# Altium project LedFlex.PrjPcb (part 4 of 4)
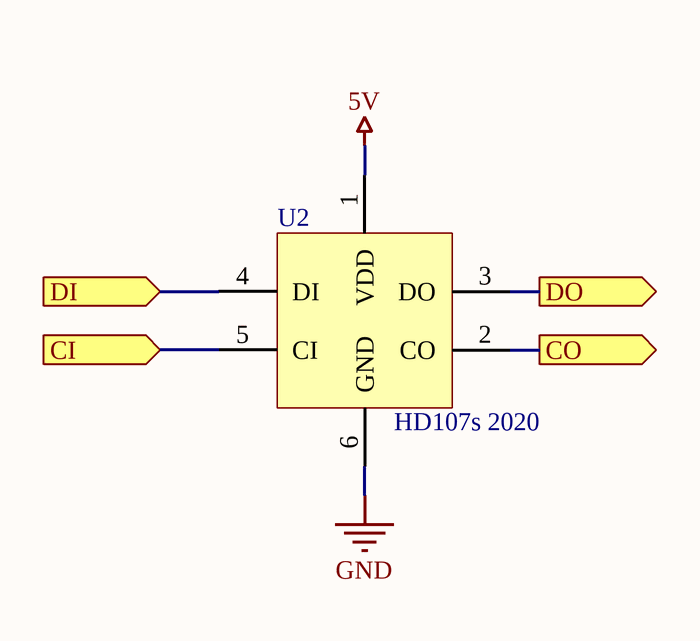
[diagram p4: LED_B.SchDoc]

## Nets that join several sheets (continued)
CI164: LEDA163 (U1_163.2), LEDA164 (U1_164.5)
CI165: LEDA164 (U1_164.2), LEDA165 (U1_165.5)
CI166: LEDA165 (U1_165.2), LEDA166 (U1_166.5)
CI167: LEDA166 (U1_166.2), LEDA167 (U1_167.5)
CI168: LEDA167 (U1_167.2), LEDA168 (U1_168.5)
CI169: LEDA168 (U1_168.2), LEDA169 (U1_169.5)
CI170: LEDA169 (U1_169.2), LEDA170 (U1_170.5)
CI171: LEDA170 (U1_170.2), LEDA171 (U1_171.5)
CI172: LEDA171 (U1_171.2), LEDA172 (U1_172.5)
CI173: LEDA172 (U1_172.2), LEDA173 (U1_173.5)
CI174: LEDA173 (U1_173.2), LEDA174 (U1_174.5)
CI175: LEDA174 (U1_174.2), LEDA175 (U1_175.5)
CI176: LEDA175 (U1_175.2), LEDA176 (U1_176.5)
CI177: LEDA176 (U1_176.2), LEDA177 (U1_177.5)
CI178: LEDA177 (U1_177.2), LEDA178 (U1_178.5)
CI179: LEDA178 (U1_178.2), LEDA179 (U1_179.5)
CI180: LEDA179 (U1_179.2), LEDA180 (U1_180.5)
CI181: LEDA180 (U1_180.2), LEDA181 (U1_181.5)
CI182: LEDA181 (U1_181.2), LEDA182 (U1_182.5)
CI183: LEDA182 (U1_182.2), LEDA183 (U1_183.5)
CI184: LEDA183 (U1_183.2), LEDA184 (U1_184.5)
CI185: LEDA184 (U1_184.2), LEDA185 (U1_185.5)
CI186: LEDA185 (U1_185.2), LEDA186 (U1_186.5)
CI187: LEDA186 (U1_186.2), LEDA187 (U1_187.5)
CI188: LEDA187 (U1_187.2), LEDA188 (U1_188.5)
CI189: LEDA188 (U1_188.2), LEDA189 (U1_189.5)
CI190: LEDA189 (U1_189.2), LEDA190 (U1_190.5)
CI191: LEDA190 (U1_190.2), LEDA191 (U1_191.5)
CI192: LEDA191 (U1_191.2), LEDA192 (U1_192.5)
CI193: LEDA192 (U1_192.2), LEDA193 (U1_193.5)
CI194: LEDA193 (U1_193.2), LEDA194 (U1_194.5)
CI195: LEDA194 (U1_194.2), LEDA195 (U1_195.5)
CI196: LEDA195 (U1_195.2), LEDA196 (U1_196.5)
CI197: LEDA196 (U1_196.2), LEDA197 (U1_197.5)
CI198: LEDA197 (U1_197.2), LEDA198 (U1_198.5)
CI199: LEDA198 (U1_198.2), LEDA199 (U1_199.5)
CI200: LEDA199 (U1_199.2), LEDA200 (U1_200.5)
CI201: LEDA200 (U1_200.2), LEDA201 (U1_201.5)
CI202: LEDA201 (U1_201.2), LEDA202 (U1_202.5)
CI203: LEDA202 (U1_202.2), LEDA203 (U1_203.5)
CI204: LEDA203 (U1_203.2), LEDA204 (U1_204.5)
CI205: LEDA204 (U1_204.2), LEDA205 (U1_205.5)
CI206: LEDA205 (U1_205.2), LEDA206 (U1_206.5)
CI207: LEDA206 (U1_206.2), LEDA207 (U1_207.5)
CI208: LEDA207 (U1_207.2), LEDA208 (U1_208.5)
CI209: LEDA208 (U1_208.2), LEDA209 (U1_209.5)
CI210: LEDA209 (U1_209.2), LEDA210 (U1_210.5)
CI211: LEDA210 (U1_210.2), LEDA211 (U1_211.5)
CI212: LEDA211 (U1_211.2), LEDA212 (U1_212.5)
CI213: LEDA212 (U1_212.2), LEDA213 (U1_213.5)
CI214: LEDA213 (U1_213.2), LEDA214 (U1_214.5)
CI215: LEDA214 (U1_214.2), LEDA215 (U1_215.5)
CI216: LEDA215 (U1_215.2), LEDA216 (U1_216.5)
CI217: LEDA216 (U1_216.2), LEDA217 (U1_217.5)
CI218: LEDA217 (U1_217.2), LEDA218 (U1_218.5)
CI219: LEDA218 (U1_218.2), LEDA219 (U1_219.5)
CI220: LEDA219 (U1_219.2), LEDA220 (U1_220.5)
CI221: LEDA220 (U1_220.2), LEDA221 (U1_221.5)
CI222: LEDA221 (U1_221.2), LEDA222 (U1_222.5)
CI223: LEDA222 (U1_222.2), LEDA223 (U1_223.5)
CI224: LEDA223 (U1_223.2), LEDA224 (U1_224.5)
CI225: LEDA224 (U1_224.2), LEDA225 (U1_225.5)
CI226: LEDA225 (U1_225.2), LEDA226 (U1_226.5)
CI227: LEDA226 (U1_226.2), LEDA227 (U1_227.5)
CI228: LEDA227 (U1_227.2), LEDA228 (U1_228.5)
CI229: LEDA228 (U1_228.2), LEDA229 (U1_229.5)
CI230: LEDA229 (U1_229.2), LEDA230 (U1_230.5)
CI231: LEDA230 (U1_230.2), LEDA231 (U1_231.5)
CI232: LEDA231 (U1_231.2), LEDA232 (U1_232.5)
CI233: LEDA232 (U1_232.2), LEDA233 (U1_233.5)
CI234: LEDA233 (U1_233.2), LEDA234 (U1_234.5)
CI235: LEDA234 (U1_234.2), LEDA235 (U1_235.5)
CI236: LEDA235 (U1_235.2), LEDA236 (U1_236.5)
CI237: LEDA236 (U1_236.2), LEDA237 (U1_237.5)
CI238: LEDA237 (U1_237.2), LEDA238 (U1_238.5)
CI239: LEDA238 (U1_238.2), LEDA239 (U1_239.5)
CI240: LEDA239 (U1_239.2), LEDA240 (U1_240.5)
CI241: LEDA240 (U1_240.2), LEDA241 (U1_241.5)
CI242: LEDA241 (U1_241.2), LEDA242 (U1_242.5)
CI243: LEDA242 (U1_242.2), LEDA243 (U1_243.5)
CI244: LEDA243 (U1_243.2), LEDA244 (U1_244.5)
CI245: LEDA244 (U1_244.2), LEDA245 (U1_245.5)
CI246: LEDA245 (U1_245.2), LEDA246 (U1_246.5)
CI247: LEDA246 (U1_246.2), LEDA247 (U1_247.5)
CI248: LEDA247 (U1_247.2), LEDA248 (U1_248.5)
CI249: LEDA248 (U1_248.2), LEDA249 (U1_249.5)
CI250: LEDA249 (U1_249.2), LEDA250 (U1_250.5)
CI251: LEDA250 (U1_250.2), LEDA251 (U1_251.5)
CI252: LEDA251 (U1_251.2), LEDA252 (U1_252.5)
CI253: LEDA252 (U1_252.2), LEDA253 (U1_253.5)
CI254: LEDA253 (U1_253.2), LEDA254 (U1_254.5)
CI255: LEDA254 (U1_254.2), LEDA255 (U1_255.5)
CI256: LEDA255 (U1_255.2), LEDA256 (U1_256.5)
DI2: LEDA1 (U1_1.3), LEDA2 (U1_2.4)
DI3: LEDA2 (U1_2.3), LEDA3 (U1_3.4)
DI4: LEDA3 (U1_3.3), LEDA4 (U1_4.4)
DI5: LEDA4 (U1_4.3), LEDA5 (U1_5.4)
DI6: LEDA5 (U1_5.3), LEDA6 (U1_6.4)
DI7: LEDA6 (U1_6.3), LEDA7 (U1_7.4)
DI8: LEDA7 (U1_7.3), LEDA8 (U1_8.4)
DI9: LEDA8 (U1_8.3), LEDA9 (U1_9.4)
DI10: LEDA9 (U1_9.3), LEDA10 (U1_10.4)
DI11: LEDA10 (U1_10.3), LEDA11 (U1_11.4)
DI12: LEDA11 (U1_11.3), LEDA12 (U1_12.4)
DI13: LEDA12 (U1_12.3), LEDA13 (U1_13.4)
DI14: LEDA13 (U1_13.3), LEDA14 (U1_14.4)
DI15: LEDA14 (U1_14.3), LEDA15 (U1_15.4)
DI16: LEDA15 (U1_15.3), LEDA16 (U1_16.4)
DI17: LEDA16 (U1_16.3), LEDA17 (U1_17.4)
DI18: LEDA17 (U1_17.3), LEDA18 (U1_18.4)
DI19: LEDA18 (U1_18.3), LEDA19 (U1_19.4)
DI20: LEDA19 (U1_19.3), LEDA20 (U1_20.4)
DI21: LEDA20 (U1_20.3), LEDA21 (U1_21.4)
DI22: LEDA21 (U1_21.3), LEDA22 (U1_22.4)
DI23: LEDA22 (U1_22.3), LEDA23 (U1_23.4)
DI24: LEDA23 (U1_23.3), LEDA24 (U1_24.4)
DI25: LEDA24 (U1_24.3), LEDA25 (U1_25.4)
DI26: LEDA25 (U1_25.3), LEDA26 (U1_26.4)
DI27: LEDA26 (U1_26.3), LEDA27 (U1_27.4)
DI28: LEDA27 (U1_27.3), LEDA28 (U1_28.4)
DI29: LEDA28 (U1_28.3), LEDA29 (U1_29.4)
DI30: LEDA29 (U1_29.3), LEDA30 (U1_30.4)
DI31: LEDA30 (U1_30.3), LEDA31 (U1_31.4)
DI32: LEDA31 (U1_31.3), LEDA32 (U1_32.4)
DI33: LEDA32 (U1_32.3), LEDA33 (U1_33.4)
DI34: LEDA33 (U1_33.3), LEDA34 (U1_34.4)
DI35: LEDA34 (U1_34.3), LEDA35 (U1_35.4)
DI36: LEDA35 (U1_35.3), LEDA36 (U1_36.4)
DI37: LEDA36 (U1_36.3), LEDA37 (U1_37.4)
DI38: LEDA37 (U1_37.3), LEDA38 (U1_38.4)
DI39: LEDA38 (U1_38.3), LEDA39 (U1_39.4)
DI40: LEDA39 (U1_39.3), LEDA40 (U1_40.4)
DI41: LEDA40 (U1_40.3), LEDA41 (U1_41.4)
DI42: LEDA41 (U1_41.3), LEDA42 (U1_42.4)
DI43: LEDA42 (U1_42.3), LEDA43 (U1_43.4)
DI44: LEDA43 (U1_43.3), LEDA44 (U1_44.4)
DI45: LEDA44 (U1_44.3), LEDA45 (U1_45.4)
DI46: LEDA45 (U1_45.3), LEDA46 (U1_46.4)
DI47: LEDA46 (U1_46.3), LEDA47 (U1_47.4)
DI48: LEDA47 (U1_47.3), LEDA48 (U1_48.4)
DI49: LEDA48 (U1_48.3), LEDA49 (U1_49.4)
DI50: LEDA49 (U1_49.3), LEDA50 (U1_50.4)
DI51: LEDA50 (U1_50.3), LEDA51 (U1_51.4)
DI52: LEDA51 (U1_51.3), LEDA52 (U1_52.4)
DI53: LEDA52 (U1_52.3), LEDA53 (U1_53.4)
DI54: LEDA53 (U1_53.3), LEDA54 (U1_54.4)
DI55: LEDA54 (U1_54.3), LEDA55 (U1_55.4)
DI56: LEDA55 (U1_55.3), LEDA56 (U1_56.4)
DI57: LEDA56 (U1_56.3), LEDA57 (U1_57.4)
DI58: LEDA57 (U1_57.3), LEDA58 (U1_58.4)
DI59: LEDA58 (U1_58.3), LEDA59 (U1_59.4)
DI60: LEDA59 (U1_59.3), LEDA60 (U1_60.4)
DI61: LEDA60 (U1_60.3), LEDA61 (U1_61.4)
DI62: LEDA61 (U1_61.3), LEDA62 (U1_62.4)
DI63: LEDA62 (U1_62.3), LEDA63 (U1_63.4)
DI64: LEDA63 (U1_63.3), LEDA64 (U1_64.4)
DI65: LEDA64 (U1_64.3), LEDA65 (U1_65.4)
DI66: LEDA65 (U1_65.3), LEDA66 (U1_66.4)
DI67: LEDA66 (U1_66.3), LEDA67 (U1_67.4)
DI68: LEDA67 (U1_67.3), LEDA68 (U1_68.4)
DI69: LEDA68 (U1_68.3), LEDA69 (U1_69.4)
DI70: LEDA69 (U1_69.3), LEDA70 (U1_70.4)
DI71: LEDA70 (U1_70.3), LEDA71 (U1_71.4)
DI72: LEDA71 (U1_71.3), LEDA72 (U1_72.4)
DI73: LEDA72 (U1_72.3), LEDA73 (U1_73.4)
DI74: LEDA73 (U1_73.3), LEDA74 (U1_74.4)
DI75: LEDA74 (U1_74.3), LEDA75 (U1_75.4)
DI76: LEDA75 (U1_75.3), LEDA76 (U1_76.4)
DI77: LEDA76 (U1_76.3), LEDA77 (U1_77.4)
DI78: LEDA77 (U1_77.3), LEDA78 (U1_78.4)
DI79: LEDA78 (U1_78.3), LEDA79 (U1_79.4)
DI80: LEDA79 (U1_79.3), LEDA80 (U1_80.4)
DI81: LEDA80 (U1_80.3), LEDA81 (U1_81.4)
DI82: LEDA81 (U1_81.3), LEDA82 (U1_82.4)
DI83: LEDA82 (U1_82.3), LEDA83 (U1_83.4)
DI84: LEDA83 (U1_83.3), LEDA84 (U1_84.4)
DI85: LEDA84 (U1_84.3), LEDA85 (U1_85.4)
DI86: LEDA85 (U1_85.3), LEDA86 (U1_86.4)
DI87: LEDA86 (U1_86.3), LEDA87 (U1_87.4)
DI88: LEDA87 (U1_87.3), LEDA88 (U1_88.4)
DI89: LEDA88 (U1_88.3), LEDA89 (U1_89.4)
DI90: LEDA89 (U1_89.3), LEDA90 (U1_90.4)
DI91: LEDA90 (U1_90.3), LEDA91 (U1_91.4)
DI92: LEDA91 (U1_91.3), LEDA92 (U1_92.4)
DI93: LEDA92 (U1_92.3), LEDA93 (U1_93.4)
DI94: LEDA93 (U1_93.3), LEDA94 (U1_94.4)
DI95: LEDA94 (U1_94.3), LEDA95 (U1_95.4)
DI96: LEDA95 (U1_95.3), LEDA96 (U1_96.4)
DI97: LEDA96 (U1_96.3), LEDA97 (U1_97.4)
DI98: LEDA97 (U1_97.3), LEDA98 (U1_98.4)
DI99: LEDA98 (U1_98.3), LEDA99 (U1_99.4)
DI100: LEDA99 (U1_99.3), LEDA100 (U1_100.4)
DI101: LEDA100 (U1_100.3), LEDA101 (U1_101.4)
DI102: LEDA101 (U1_101.3), LEDA102 (U1_102.4)
DI103: LEDA102 (U1_102.3), LEDA103 (U1_103.4)
DI104: LEDA103 (U1_103.3), LEDA104 (U1_104.4)
DI105: LEDA104 (U1_104.3), LEDA105 (U1_105.4)
DI106: LEDA105 (U1_105.3), LEDA106 (U1_106.4)
DI107: LEDA106 (U1_106.3), LEDA107 (U1_107.4)
DI108: LEDA107 (U1_107.3), LEDA108 (U1_108.4)
DI109: LEDA108 (U1_108.3), LEDA109 (U1_109.4)
DI110: LEDA109 (U1_109.3), LEDA110 (U1_110.4)
DI111: LEDA110 (U1_110.3), LEDA111 (U1_111.4)
DI112: LEDA111 (U1_111.3), LEDA112 (U1_112.4)
DI113: LEDA112 (U1_112.3), LEDA113 (U1_113.4)
DI114: LEDA113 (U1_113.3), LEDA114 (U1_114.4)
DI115: LEDA114 (U1_114.3), LEDA115 (U1_115.4)
DI116: LEDA115 (U1_115.3), LEDA116 (U1_116.4)
DI117: LEDA116 (U1_116.3), LEDA117 (U1_117.4)
DI118: LEDA117 (U1_117.3), LEDA118 (U1_118.4)
DI119: LEDA118 (U1_118.3), LEDA119 (U1_119.4)
DI120: LEDA119 (U1_119.3), LEDA120 (U1_120.4)
DI121: LEDA120 (U1_120.3), LEDA121 (U1_121.4)
DI122: LEDA121 (U1_121.3), LEDA122 (U1_122.4)
DI123: LEDA122 (U1_122.3), LEDA123 (U1_123.4)
DI124: LEDA123 (U1_123.3), LEDA124 (U1_124.4)
DI125: LEDA124 (U1_124.3), LEDA125 (U1_125.4)
DI126: LEDA125 (U1_125.3), LEDA126 (U1_126.4)
DI127: LEDA126 (U1_126.3), LEDA127 (U1_127.4)
DI128: LEDA127 (U1_127.3), LEDA128 (U1_128.4)
DI129: LEDA128 (U1_128.3), LEDA129 (U1_129.4)
DI130: LEDA129 (U1_129.3), LEDA130 (U1_130.4)
DI131: LEDA130 (U1_130.3), LEDA131 (U1_131.4)
DI132: LEDA131 (U1_131.3), LEDA132 (U1_132.4)
DI133: LEDA132 (U1_132.3), LEDA133 (U1_133.4)
DI134: LEDA133 (U1_133.3), LEDA134 (U1_134.4)
DI135: LEDA134 (U1_134.3), LEDA135 (U1_135.4)
DI136: LEDA135 (U1_135.3), LEDA136 (U1_136.4)
DI137: LEDA136 (U1_136.3), LEDA137 (U1_137.4)
DI138: LEDA137 (U1_137.3), LEDA138 (U1_138.4)
DI139: LEDA138 (U1_138.3), LEDA139 (U1_139.4)
DI140: LEDA139 (U1_139.3), LEDA140 (U1_140.4)
DI141: LEDA140 (U1_140.3), LEDA141 (U1_141.4)
DI142: LEDA141 (U1_141.3), LEDA142 (U1_142.4)
DI143: LEDA142 (U1_142.3), LEDA143 (U1_143.4)
DI144: LEDA143 (U1_143.3), LEDA144 (U1_144.4)
DI145: LEDA144 (U1_144.3), LEDA145 (U1_145.4)
DI146: LEDA145 (U1_145.3), LEDA146 (U1_146.4)
DI147: LEDA146 (U1_146.3), LEDA147 (U1_147.4)
DI148: LEDA147 (U1_147.3), LEDA148 (U1_148.4)
DI149: LEDA148 (U1_148.3), LEDA149 (U1_149.4)
DI150: LEDA149 (U1_149.3), LEDA150 (U1_150.4)
DI151: LEDA150 (U1_150.3), LEDA151 (U1_151.4)
DI152: LEDA151 (U1_151.3), LEDA152 (U1_152.4)
DI153: LEDA152 (U1_152.3), LEDA153 (U1_153.4)
DI154: LEDA153 (U1_153.3), LEDA154 (U1_154.4)
DI155: LEDA154 (U1_154.3), LEDA155 (U1_155.4)
DI156: LEDA155 (U1_155.3), LEDA156 (U1_156.4)
DI157: LEDA156 (U1_156.3), LEDA157 (U1_157.4)
DI158: LEDA157 (U1_157.3), LEDA158 (U1_158.4)
DI159: LEDA158 (U1_158.3), LEDA159 (U1_159.4)
DI160: LEDA159 (U1_159.3), LEDA160 (U1_160.4)
DI161: LEDA160 (U1_160.3), LEDA161 (U1_161.4)
DI162: LEDA161 (U1_161.3), LEDA162 (U1_162.4)
DI163: LEDA162 (U1_162.3), LEDA163 (U1_163.4)
DI164: LEDA163 (U1_163.3), LEDA164 (U1_164.4)
DI165: LEDA164 (U1_164.3), LEDA165 (U1_165.4)
DI166: LEDA165 (U1_165.3), LEDA166 (U1_166.4)
DI167: LEDA166 (U1_166.3), LEDA167 (U1_167.4)
DI168: LEDA167 (U1_167.3), LEDA168 (U1_168.4)
DI169: LEDA168 (U1_168.3), LEDA169 (U1_169.4)
DI170: LEDA169 (U1_169.3), LEDA170 (U1_170.4)
DI171: LEDA170 (U1_170.3), LEDA171 (U1_171.4)
DI172: LEDA171 (U1_171.3), LEDA172 (U1_172.4)
DI173: LEDA172 (U1_172.3), LEDA173 (U1_173.4)
DI174: LEDA173 (U1_173.3), LEDA174 (U1_174.4)
DI175: LEDA174 (U1_174.3), LEDA175 (U1_175.4)
DI176: LEDA175 (U1_175.3), LEDA176 (U1_176.4)
DI177: LEDA176 (U1_176.3), LEDA177 (U1_177.4)
DI178: LEDA177 (U1_177.3), LEDA178 (U1_178.4)
DI179: LEDA178 (U1_178.3), LEDA179 (U1_179.4)
DI180: LEDA179 (U1_179.3), LEDA180 (U1_180.4)
DI181: LEDA180 (U1_180.3), LEDA181 (U1_181.4)
DI182: LEDA181 (U1_181.3), LEDA182 (U1_182.4)
DI183: LEDA182 (U1_182.3), LEDA183 (U1_183.4)
DI184: LEDA183 (U1_183.3), LEDA184 (U1_184.4)
DI185: LEDA184 (U1_184.3), LEDA185 (U1_185.4)
DI186: LEDA185 (U1_185.3), LEDA186 (U1_186.4)
DI187: LEDA186 (U1_186.3), LEDA187 (U1_187.4)
DI188: LEDA187 (U1_187.3), LEDA188 (U1_188.4)
DI189: LEDA188 (U1_188.3), LEDA189 (U1_189.4)
DI190: LEDA189 (U1_189.3), LEDA190 (U1_190.4)
DI191: LEDA190 (U1_190.3), LEDA191 (U1_191.4)
DI192: LEDA191 (U1_191.3), LEDA192 (U1_192.4)
DI193: LEDA192 (U1_192.3), LEDA193 (U1_193.4)
DI194: LEDA193 (U1_193.3), LEDA194 (U1_194.4)
DI195: LEDA194 (U1_194.3), LEDA195 (U1_195.4)
DI196: LEDA195 (U1_195.3), LEDA196 (U1_196.4)
DI197: LEDA196 (U1_196.3), LEDA197 (U1_197.4)
DI198: LEDA197 (U1_197.3), LEDA198 (U1_198.4)
DI199: LEDA198 (U1_198.3), LEDA199 (U1_199.4)
DI200: LEDA199 (U1_199.3), LEDA200 (U1_200.4)
DI201: LEDA200 (U1_200.3), LEDA201 (U1_201.4)
DI202: LEDA201 (U1_201.3), LEDA202 (U1_202.4)
DI203: LEDA202 (U1_202.3), LEDA203 (U1_203.4)
DI204: LEDA203 (U1_203.3), LEDA204 (U1_204.4)
DI205: LEDA204 (U1_204.3), LEDA205 (U1_205.4)
DI206: LEDA205 (U1_205.3), LEDA206 (U1_206.4)
DI207: LEDA206 (U1_206.3), LEDA207 (U1_207.4)
DI208: LEDA207 (U1_207.3), LEDA208 (U1_208.4)
DI209: LEDA208 (U1_208.3), LEDA209 (U1_209.4)
DI210: LEDA209 (U1_209.3), LEDA210 (U1_210.4)
DI211: LEDA210 (U1_210.3), LEDA211 (U1_211.4)
DI212: LEDA211 (U1_211.3), LEDA212 (U1_212.4)
DI213: LEDA212 (U1_212.3), LEDA213 (U1_213.4)
DI214: LEDA213 (U1_213.3), LEDA214 (U1_214.4)
DI215: LEDA214 (U1_214.3), LEDA215 (U1_215.4)
DI216: LEDA215 (U1_215.3), LEDA216 (U1_216.4)
DI217: LEDA216 (U1_216.3), LEDA217 (U1_217.4)
DI218: LEDA217 (U1_217.3), LEDA218 (U1_218.4)
DI219: LEDA218 (U1_218.3), LEDA219 (U1_219.4)
DI220: LEDA219 (U1_219.3), LEDA220 (U1_220.4)
DI221: LEDA220 (U1_220.3), LEDA221 (U1_221.4)
DI222: LEDA221 (U1_221.3), LEDA222 (U1_222.4)
DI223: LEDA222 (U1_222.3), LEDA223 (U1_223.4)
DI224: LEDA223 (U1_223.3), LEDA224 (U1_224.4)
DI225: LEDA224 (U1_224.3), LEDA225 (U1_225.4)
DI226: LEDA225 (U1_225.3), LEDA226 (U1_226.4)
DI227: LEDA226 (U1_226.3), LEDA227 (U1_227.4)
DI228: LEDA227 (U1_227.3), LEDA228 (U1_228.4)
DI229: LEDA228 (U1_228.3), LEDA229 (U1_229.4)
DI230: LEDA229 (U1_229.3), LEDA230 (U1_230.4)
DI231: LEDA230 (U1_230.3), LEDA231 (U1_231.4)
DI232: LEDA231 (U1_231.3), LEDA232 (U1_232.4)
DI233: LEDA232 (U1_232.3), LEDA233 (U1_233.4)
DI234: LEDA233 (U1_233.3), LEDA234 (U1_234.4)
DI235: LEDA234 (U1_234.3), LEDA235 (U1_235.4)
DI236: LEDA235 (U1_235.3), LEDA236 (U1_236.4)
DI237: LEDA236 (U1_236.3), LEDA237 (U1_237.4)
DI238: LEDA237 (U1_237.3), LEDA238 (U1_238.4)
DI239: LEDA238 (U1_238.3), LEDA239 (U1_239.4)
DI240: LEDA239 (U1_239.3), LEDA240 (U1_240.4)
DI241: LEDA240 (U1_240.3), LEDA241 (U1_241.4)
DI242: LEDA241 (U1_241.3), LEDA242 (U1_242.4)
DI243: LEDA242 (U1_242.3), LEDA243 (U1_243.4)
DI244: LEDA243 (U1_243.3), LEDA244 (U1_244.4)
DI245: LEDA244 (U1_244.3), LEDA245 (U1_245.4)
DI246: LEDA245 (U1_245.3), LEDA246 (U1_246.4)
DI247: LEDA246 (U1_246.3), LEDA247 (U1_247.4)
DI248: LEDA247 (U1_247.3), LEDA248 (U1_248.4)
DI249: LEDA248 (U1_248.3), LEDA249 (U1_249.4)
DI250: LEDA249 (U1_249.3), LEDA250 (U1_250.4)
DI251: LEDA250 (U1_250.3), LEDA251 (U1_251.4)
DI252: LEDA251 (U1_251.3), LEDA252 (U1_252.4)
DI253: LEDA252 (U1_252.3), LEDA253 (U1_253.4)
DI254: LEDA253 (U1_253.3), LEDA254 (U1_254.4)
DI255: LEDA254 (U1_254.3), LEDA255 (U1_255.4)
DI256: LEDA255 (U1_255.3), LEDA256 (U1_256.4)

## Assembly variants
Main: all parts fitted